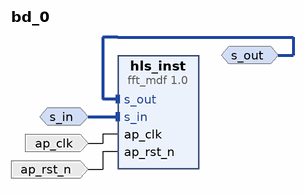
[diagram p0: block diagram of the top level]
# Vivado block design bd_0, xc7a200tfbg676-2, Vivado 2023.2
create_bd_design bd_0

create_bd_intf_port -mode Slave -vlnv xilinx.com:interface:axis_rtl:1.0 s_in
set_property -dict [list \
  CONFIG.FREQ_HZ 100000000.0 \
  CONFIG.HAS_TKEEP 1 \
  CONFIG.HAS_TLAST 1 \
  CONFIG.HAS_TREADY 1 \
  CONFIG.HAS_TSTRB 1 \
  CONFIG.LAYERED_METADATA undef \
  CONFIG.TDATA_NUM_BYTES 16 \
  CONFIG.TDEST_WIDTH 1 \
  CONFIG.TID_WIDTH 1 \
  CONFIG.TUSER_WIDTH 1 \
] [get_bd_intf_ports s_in]
create_bd_intf_port -mode Master -vlnv xilinx.com:interface:axis_rtl:1.0 s_out
set_property -dict {CONFIG.FREQ_HZ 100000000.0} [get_bd_intf_ports s_out]
create_bd_port -dir I -type clk ap_clk
set_property -dict {CONFIG.FREQ_HZ 100000000.0} [get_bd_ports ap_clk]
create_bd_port -dir I -type rst ap_rst_n

create_bd_cell -type ip -vlnv xilinx.com:hls:fft_mdf:1.0 hls_inst

# ---- connections ----

connect_bd_intf_net [get_bd_intf_ports s_out] [get_bd_intf_pins hls_inst/s_out]
connect_bd_intf_net -intf_net s_in_0_1 [get_bd_intf_ports s_in] [get_bd_intf_pins hls_inst/s_in]
connect_bd_net -net ap_clk_0_1 [get_bd_ports ap_clk] [get_bd_pins hls_inst/ap_clk]
connect_bd_net -net ap_rst_n_0_1 [get_bd_ports ap_rst_n] [get_bd_pins hls_inst/ap_rst_n]

validate_bd_design
save_bd_design
